# EAGLE design SECDONGL_001 (EAGLE 7.7.0)

## Sheet 1 of 3
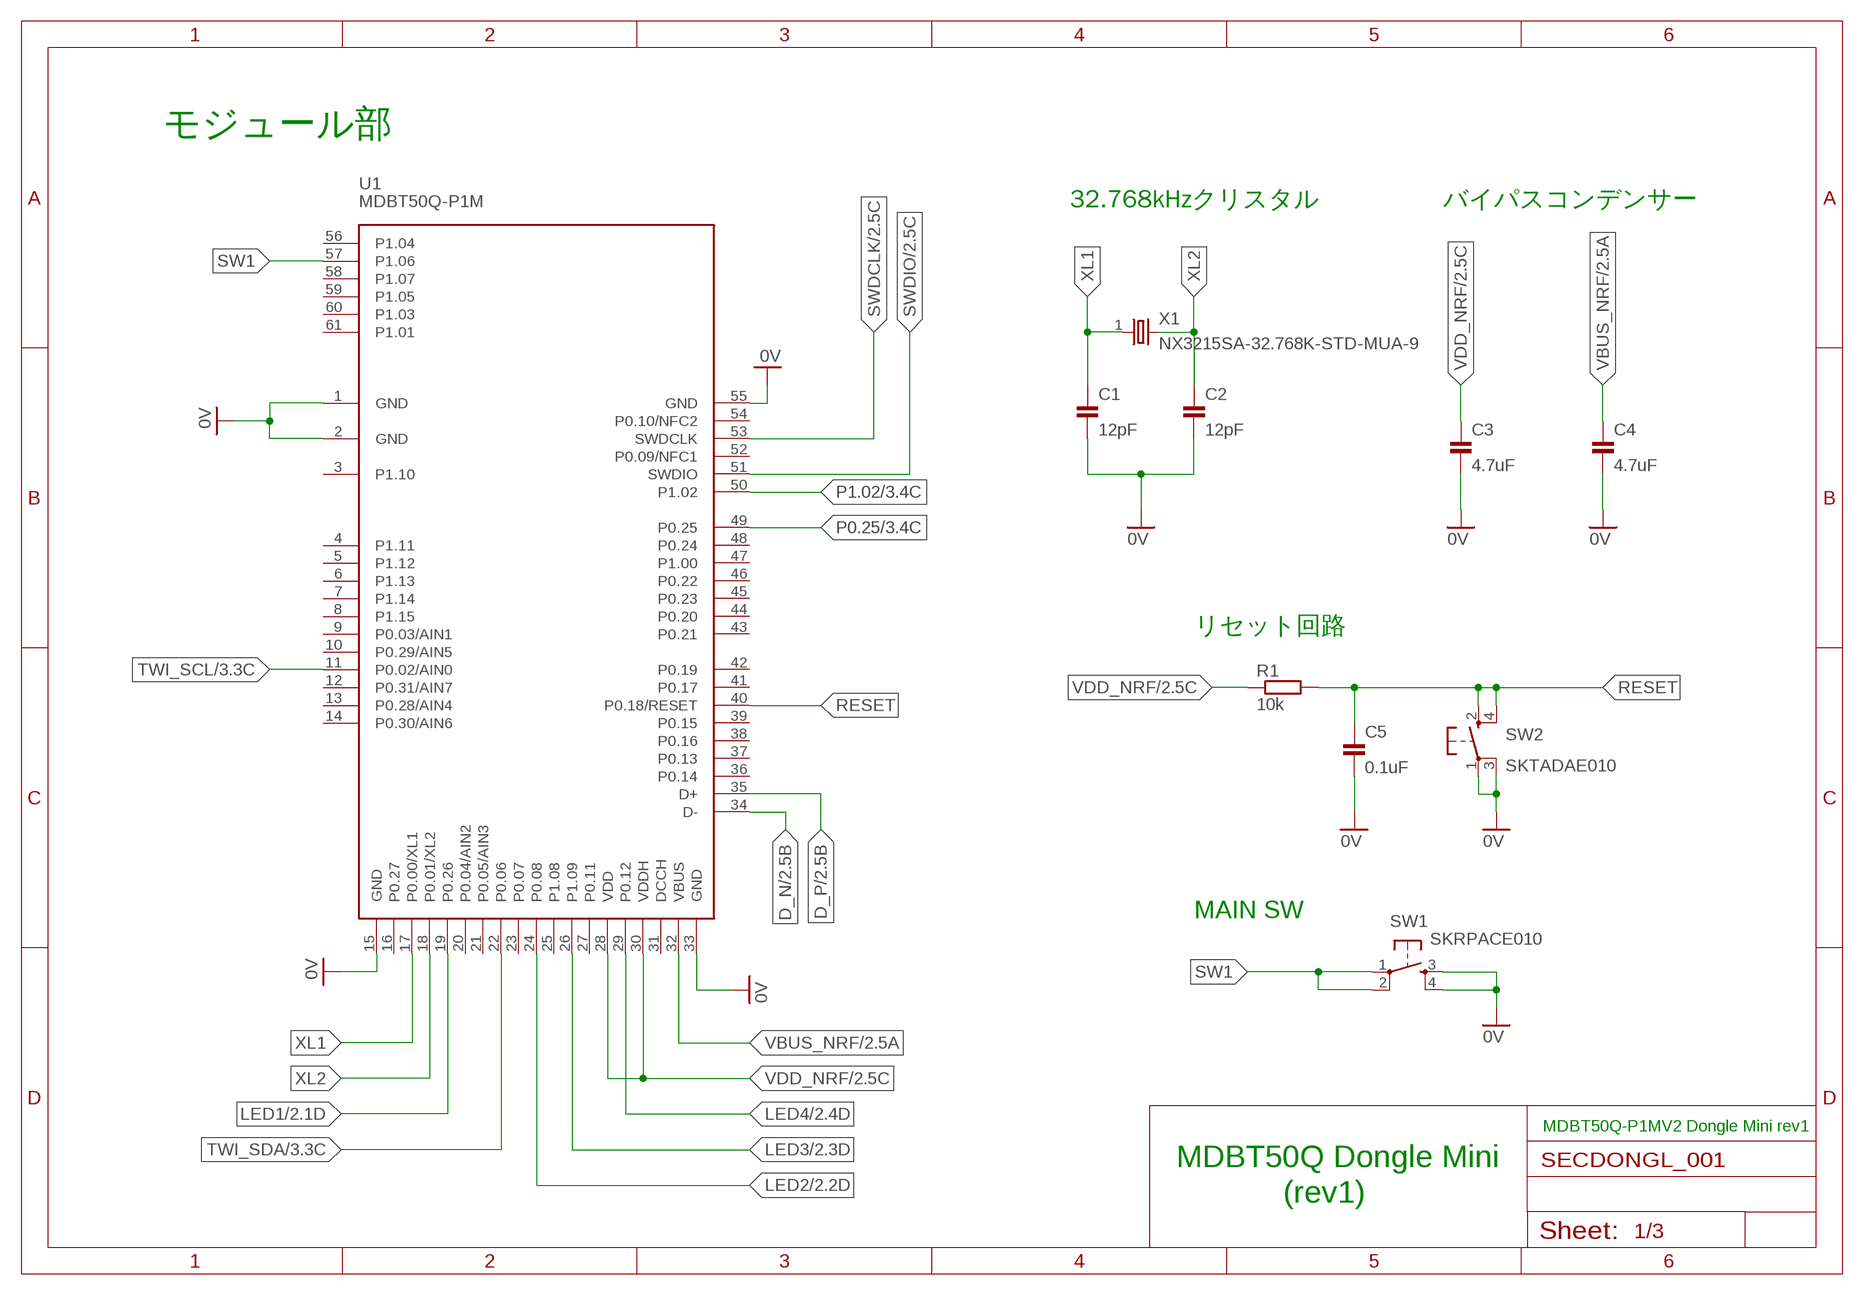
[diagram p0: schematic, sheet 1]

### Parts
C1  12pF  CAP_0603  [C0603K]
C2  12pF  CAP_0603  [C0603K]
C3  4.7uF  CAP_0603  [C0603K]
C4  4.7uF  CAP_0603  [C0603K]
C5  0.1uF  CAP_0402K  [C0402K]
R1  10k  RESISTOR_0402  [R0402]
SW1  SKRPACE010  [SKRPACE010]
SW2  SKTADAE010  [SKTADAE010]
U1  MDBT50Q-P1M  [MDBT50Q-P1M]
X1  NX3215SA-32.768K-STD-MUA-9  [NX3215]

### Nets
0V: C1.2 C2.2 C3.2 C4.2 C5.2 SW1.3(S) SW1.4(S1) SW2.1(P) SW2.3(P1) U1.1(GND) U1.2(GND) U1.15(GND) U1.33(GND) U1.55(GND) ; also sheet 2,3
D_N: U1.34(D-) ; also sheet 2
D_P: U1.35(D+) ; also sheet 2
LED1: U1.19(P0.26) ; also sheet 2
LED2: U1.24(P0.08) ; also sheet 2
LED3: U1.26(P1.09) ; also sheet 2
LED4: U1.29(P0.12) ; also sheet 2
P0.25: U1.49(P0.25) ; also sheet 3
P1.02: U1.50(P1.02) ; also sheet 3
RESET: C5.1 R1.2 SW2.2(S) SW2.4(S1) U1.40(P0.18/RESET)
SW1: SW1.1(P) SW1.2(P1) U1.57(P1.06)
SWDCLK: U1.53(SWDCLK) ; also sheet 2
SWDIO: U1.51(SWDIO) ; also sheet 2
TWI_SCL: U1.11(P0.02/AIN0) ; also sheet 3
TWI_SDA: U1.22(P0.06) ; also sheet 3
VBUS_NRF: C4.1 U1.32(VBUS) ; also sheet 2,3
VDD_NRF: C3.1 R1.1 U1.28(VDD) U1.30(VDDH) ; also sheet 2,3
XL1: C1.1 U1.17(P0.00/XL1) X1.1
XL2: C2.1 U1.18(P0.01/XL2) X1.2
Unconnected: U1.3(P1.10) U1.4(P1.11) U1.5(P1.12) U1.6(P1.13) U1.7(P1.14) U1.8(P1.15) U1.9(P0.03/AIN1) U1.10(P0.29/AIN5) U1.12(P0.31/AIN7) U1.13(P0.28/AIN4) U1.14(P0.30/AIN6) U1.16(P0.27) U1.20(P0.04/AIN2) U1.21(P0.05/AIN3) U1.23(P0.07) U1.25(P1.08) U1.27(P0.11) U1.31(DCCH) U1.36(P0.14) U1.37(P0.13) U1.38(P0.16) U1.39(P0.15) U1.41(P0.17) U1.42(P0.19) U1.43(P0.21) U1.44(P0.20) U1.45(P0.23) U1.46(P0.22) U1.47(P1.00) U1.48(P0.24) U1.52(P0.09/NFC1) U1.54(P0.10/NFC2) U1.56(P1.04) U1.58(P1.07) U1.59(P1.05) U1.60(P1.03) U1.61(P1.01)

### Notes on the sheet
- モジュール部
- 32.768kHzクリスタル | バイパスコンデンサー
- リセット回路
- MAIN SW
- MDBT50Q-P1MV2 Dongle Mini rev1
- MDBT50Q Dongle Mini
- (rev1)

## Sheet 2 of 3
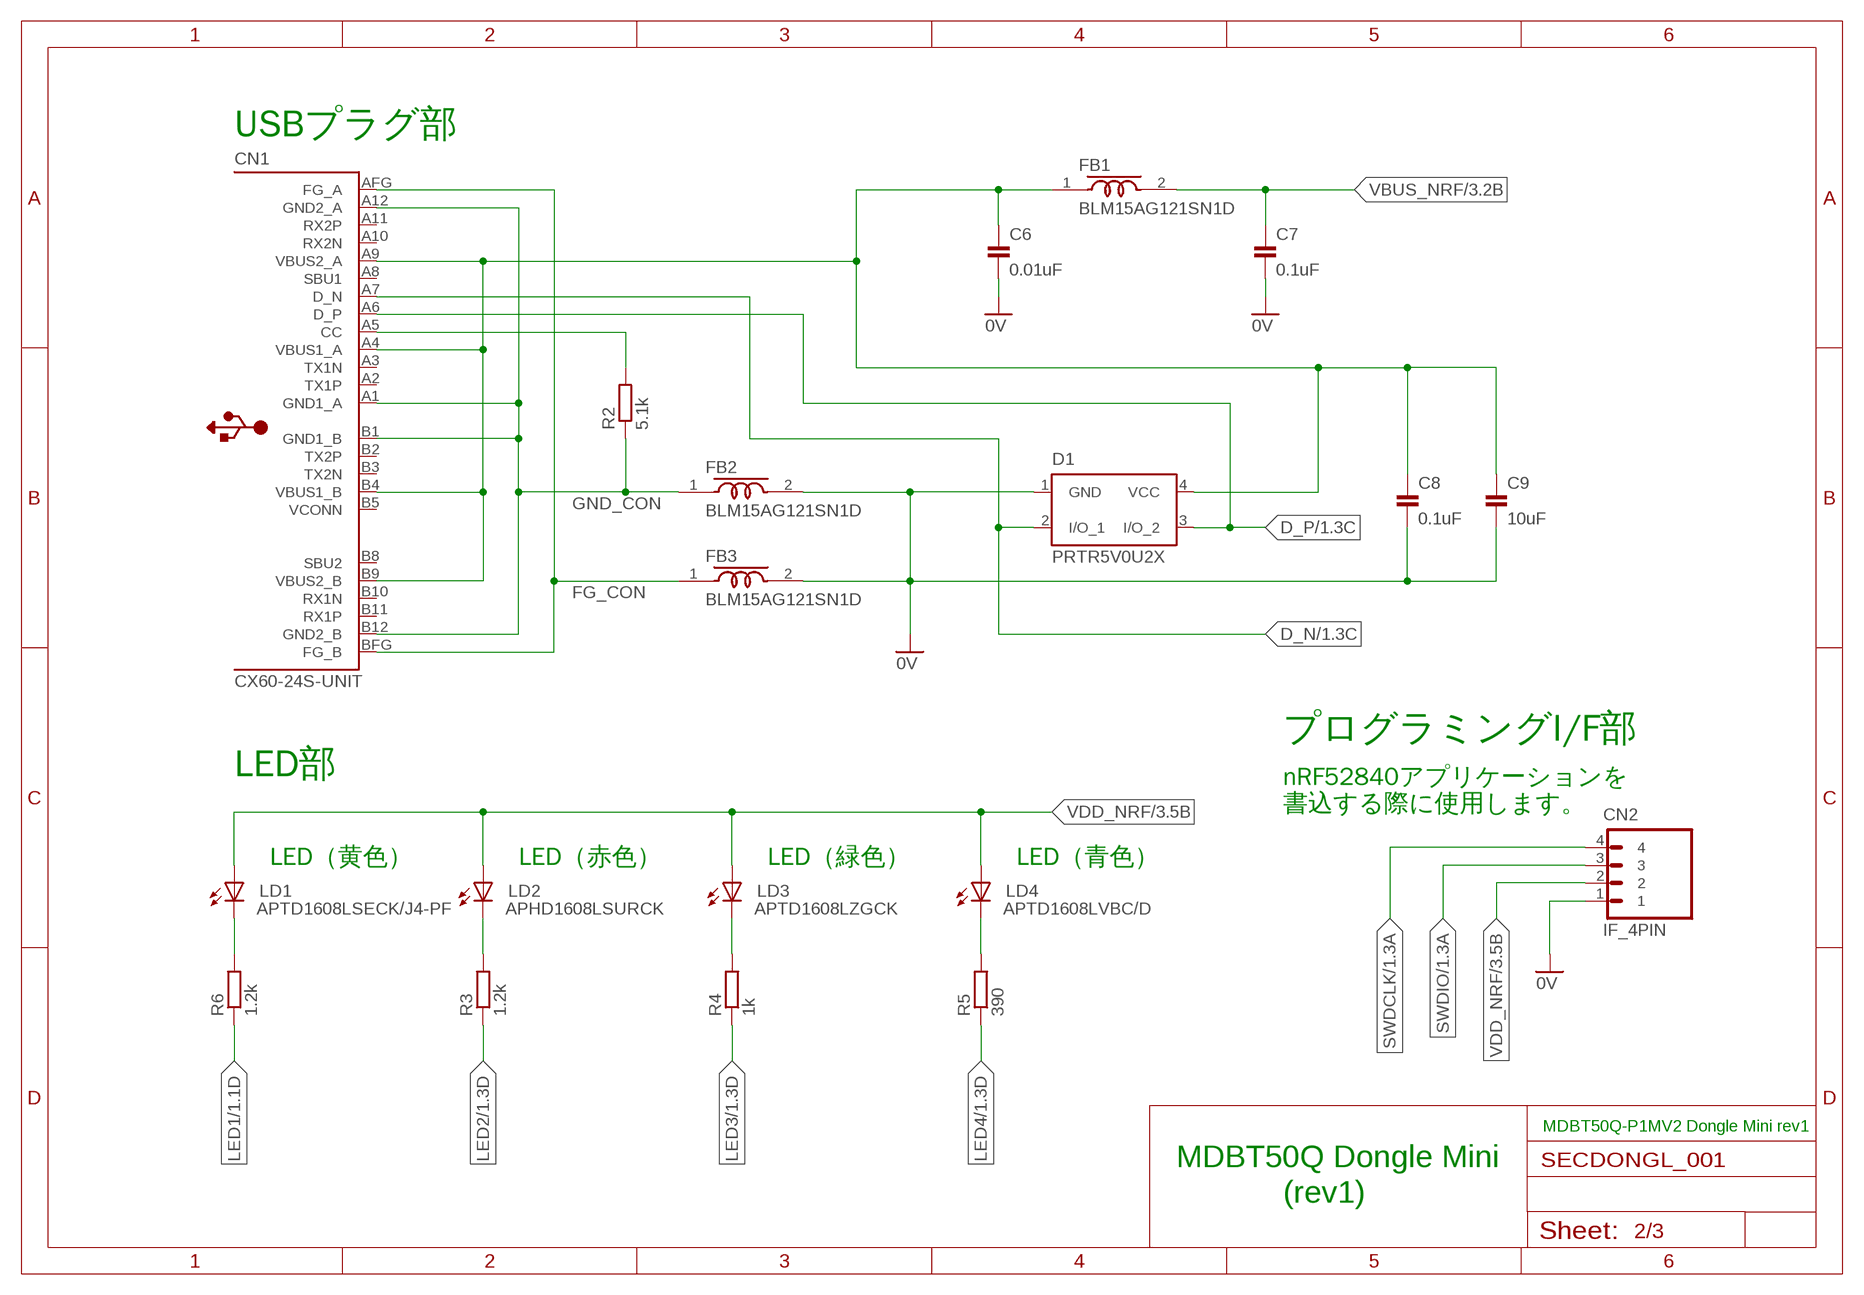
[diagram p1: schematic, sheet 2]

### Parts
C6  0.01uF  CAP_0402K  [C0402K]
C7  0.1uF  CAP_0402K  [C0402K]
C8  0.1uF  CAP_0402K  [C0402K]
C9  10uF  CAP_0603  [C0603K]
CN1  CX60-24S-UNIT  [CX60-24S-UNIT]
CN2  IF_4PIN  [HEADER_4PIN]
D1  PRTR5V0U2X  [SOT143B]
FB1  BLM15AG121SN1D  [C0402K]
FB2  BLM15AG121SN1D  [C0402K]
FB3  BLM15AG121SN1D  [C0402K]
LD1  APTD1608LSECK/J4-PF  [APTD1608]
LD2  APHD1608LSURCK  [APTD1608]
LD3  APTD1608LZGCK  [APTD1608]
LD4  APTD1608LVBC/D  [APTD1608]
R2  5.1k  RESISTOR_0402  [R0402]
R3  1.2k  RESISTOR_0402  [R0402]
R4  1k  RESISTOR_0402  [R0402]
R5  390  RESISTOR_0402  [R0402]
R6  1.2k  RESISTOR_0402  [R0402]

### Nets
0V: C6.2 C7.2 C8.2 C9.2 CN2.1 D1.1(GND) FB2.2 FB3.2 ; also sheet 1,3
D_N: CN1.A7(D_N) D1.2(I/O_1) ; also sheet 1
D_P: CN1.A6(D_P) D1.3(I/O_2) ; also sheet 1
FG_CON: CN1.AFG(FG_A) CN1.BFG(FG_B) FB3.1
GND_CON: CN1.A1(GND1_A) CN1.A12(GND2_A) CN1.B1(GND1_B) CN1.B12(GND2_B) FB2.1 R2.1
LED1: R6.1 ; also sheet 1
LED2: R3.1 ; also sheet 1
LED3: R4.1 ; also sheet 1
LED4: R5.1 ; also sheet 1
N$1: LD4.C R5.2
N$2: CN1.A5(CC) R2.2
N$6: LD3.C R4.2
N$7: LD2.C R3.2
N$8: LD1.C R6.2
SWDCLK: CN2.4 ; also sheet 1
SWDIO: CN2.3 ; also sheet 1
VBUS: C6.1 C8.1 C9.1 CN1.A4(VBUS1_A) CN1.A9(VBUS2_A) CN1.B4(VBUS1_B) CN1.B9(VBUS2_B) D1.4(VCC) FB1.1
VBUS_NRF: C7.1 FB1.2 ; also sheet 1,3
VDD_NRF: CN2.2 LD1.A LD2.A LD3.A LD4.A ; also sheet 1,3
Unconnected: CN1.A2(TX1P) CN1.A3(TX1N) CN1.A8(SBU1) CN1.A10(RX2N) CN1.A11(RX2P) CN1.B2(TX2P) CN1.B3(TX2N) CN1.B5(VCONN) CN1.B8(SBU2) CN1.B10(RX1N) CN1.B11(RX1P)

### Notes on the sheet
- USBプラグ部
- プログラミングI/F部
- LED部
- nRF52840アプリケーションを
  書込する際に使用します。
- LED（黄色） | LED（赤色） | LED（緑色） | LED（青色）
- MDBT50Q-P1MV2 Dongle Mini rev1
- MDBT50Q Dongle Mini
- (rev1)

## Sheet 3 of 3
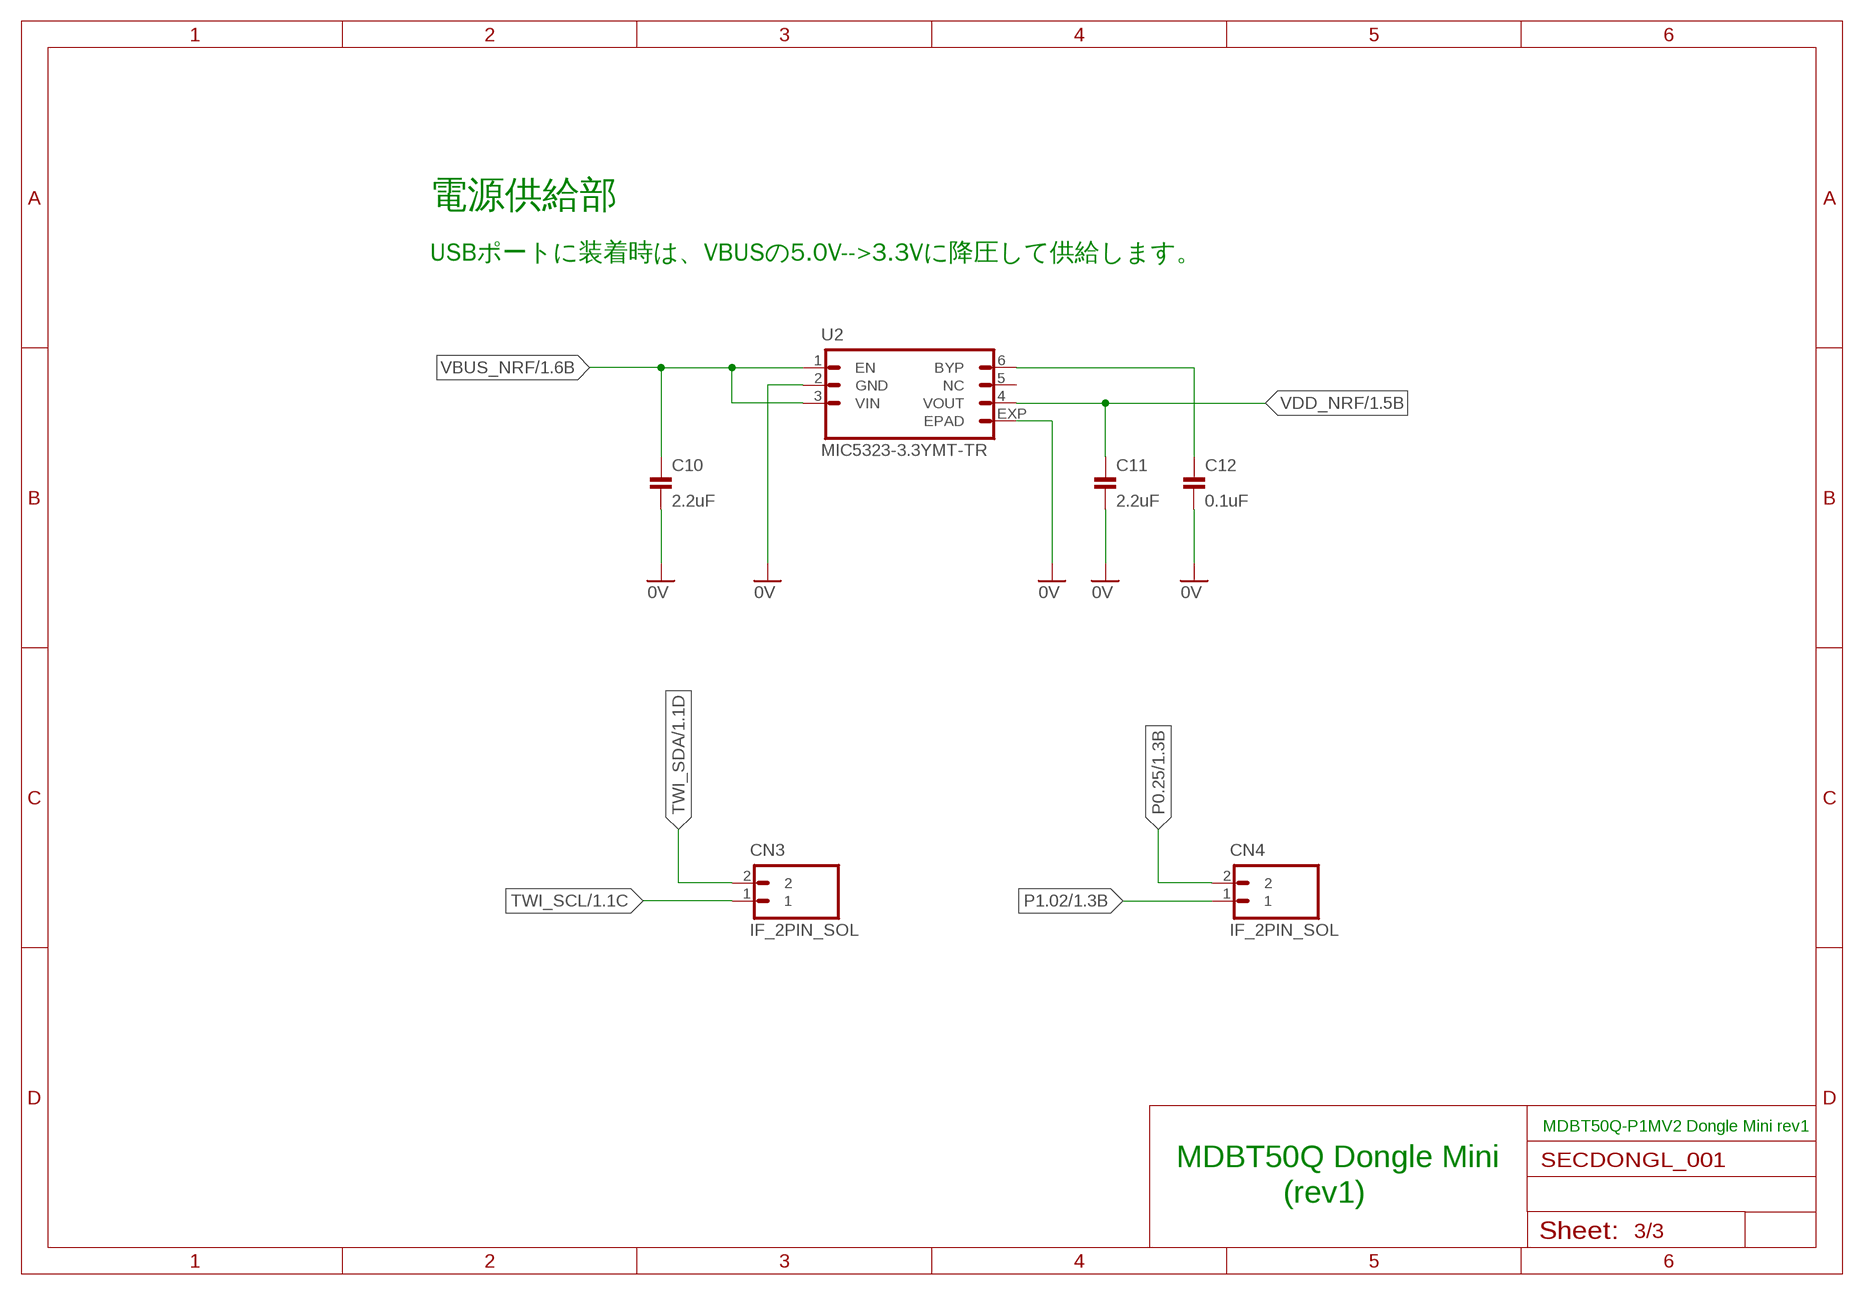
[diagram p2: schematic, sheet 3]

### Parts
C10  2.2uF  CAP_0603  [C0603K]
C11  2.2uF  CAP_0603  [C0603K]
C12  0.1uF  CAP_0402K  [C0402K]
CN3  IF_2PIN_SOL  [SOLPAD_2PIN]
CN4  IF_2PIN_SOL  [SOLPAD_2PIN]
U2  MIC5323-3.3YMT-TR  [6-VDFN(2X2)]

### Nets
0V: C10.2 C11.2 C12.2 U2.2(GND) U2.EXP(EPAD) ; also sheet 1,2
N$4: C12.1 U2.6(BYP)
P0.25: CN4.2 ; also sheet 1
P1.02: CN4.1 ; also sheet 1
TWI_SCL: CN3.1 ; also sheet 1
TWI_SDA: CN3.2 ; also sheet 1
VBUS_NRF: C10.1 U2.1(EN) U2.3(VIN) ; also sheet 1,2
VDD_NRF: C11.1 U2.4(VOUT) ; also sheet 1,2
Unconnected: U2.5(NC)

### Notes on the sheet
- 電源供給部
- USBポートに装着時は、VBUSの5.0V-->3.3Vに降圧して供給します。
- MDBT50Q-P1MV2 Dongle Mini rev1
- MDBT50Q Dongle Mini
- (rev1)

## Library data of the parts
C1-C12 = Parts:CAP: コンデンサー
CN1 = Connectors:CX60-24S-UNIT: USB Type-C(TM) plug
CN2 = Connectors:IF_4PIN: 4-pin インターフェース
CN3 CN4 = Connectors:IF_2PIN: 2-pin インターフェース
D1 = Parts:PRTR5V0U2X: ESD protection diode
FB1-FB3 = Parts:BLM15AG: フェライトビーズ EMIFIL®
LD1 LD3 LD4 = Parts:APTD1608: 発光ダイオード
LD2 = Parts:APHD1608: 発光ダイオード
R1-R6 = Parts:RESISTOR: 抵抗器
SW1 = Parts:SKRPACE010: 表面実装用タクトスイッチ ４．２×３．２ｍｍ小型重作動力タイプ ・作動力：２．５５Ｎ ・操作方向：垂直 ・移動量：０．２ｍｍ ・動作寿命：５０，０００ｃｙｃｌｅｓ （５ｍＡ ５ＶＤＣ） ・初期接触抵抗：最大５００ｍΩ
SW2 = Parts:SKTADAE010: 表面実装用タクトスイッチ 2.6×1.6ｍｍ小型重作動力タイプ ・作動力：2.4 N ・操作方向：垂直 ・移動量：0.11 mm ・定格：50 mA 12 VDC
U1 = Modules:MDBT50Q-P1M: MDBT50Q – P1M (PCB Antenna) Bluetooth 5, IEEE 802.15.4, 2.4 GHz transceiver ARM Cortex –M4 32-bit processor with FPU, 64 MHz Memory: 1MB flash / 256KB RAM ‧Supply voltage range 1.7V to 5.5V ‧On-chip DC/DC and LDO regulators with automated low current modes ‧Regulated supply for external components from 1.8V to 3.3V ‧0.4uA at 3V in System OFF mode, no RAM retention ‧1.5uA at 3V in System ON mode, no RAM retention, wake on RTC Working distance 1Mbps: up to 250 meters in open space 2Mbps: up to 120 meters in open space
U2 = ICs:MIC5323: Ultra-Low Dropout LDO Regulator 電圧 - 入力（最大）：5.5V 電圧 - 出力（最小/固定）：3.3V 電流 - 出力：500mA 動作温度：-40°C～125°C
X1 = Parts:NX3215SA: 水晶振動子 周波数 32.768kHz 周波数公差 ±20ppm 負荷容量 6pF ESR（等価直列抵抗） 70 kOhms 動作温度 -40°C～85°C

## Board
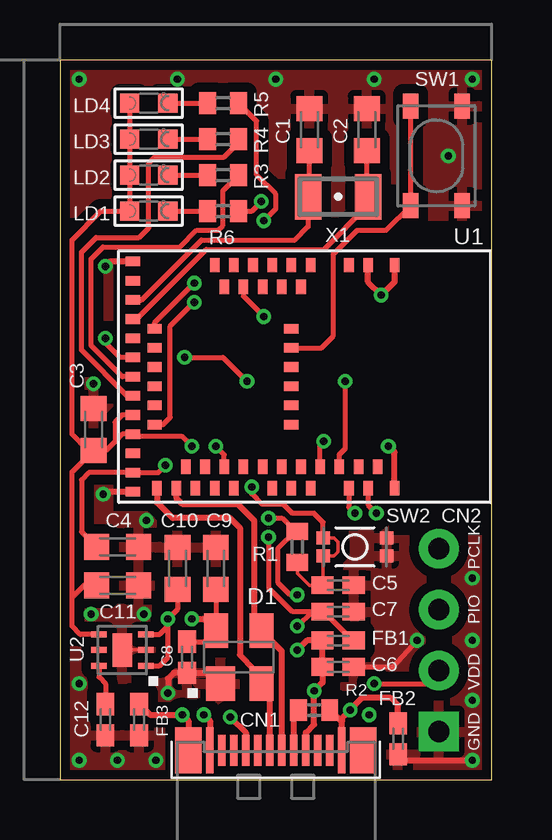
[diagram p3: board, top side]
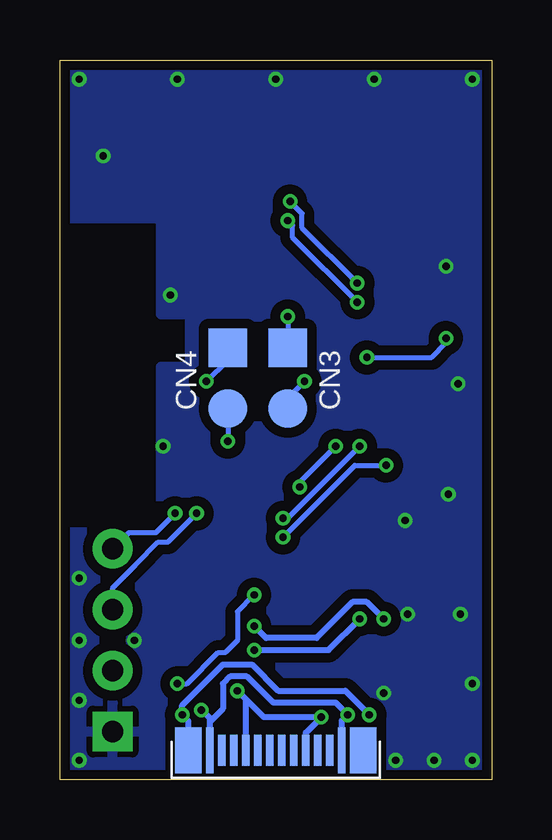
[diagram p4: board, bottom side, seen from below]

Size 18 x 30 mm. Coordinates in mm from the lower left corner, seen from the top.
Outline: 0,0 18,0 18,30 0,30 0,0
Copper layers (1*16): Top 0.035mm / dielectric 1.5mm / Bottom 0.035mm
Design rules "SeeedStudio_2layer_DRU_no_angle_20140221": minimum track width 6mil, minimum drill 12mil, track to track 6mil, track to pad 6mil, pad to pad 6mil, via to via 6mil, smd to smd 0mil, copper to edge 10mil, drill to drill 10mil, minimum pad ring 10mil, minimum via ring 6mil, stop-mask expansion 2mil, vias tented up to drill 100mil, thermal gap 10mil

### Footprints (pad centres in the part's own frame; a part is rotated, then mirrored left to right if it is on the bottom)
C0603K = smd 1.05 x 1.08: 1 -0.875,0; 2 0.875,0
C0402K = smd 0.925 x 0.74: 1 -0.65,0; 2 0.65,0
CX60-24S-UNIT = smd 0.3 x 1.9: A1 2.75,0; A12 -2.75,0 | smd 0.3 x 1.3: A2 2.25,0; A3 1.75,0; A4 1.25,0; A5 0.75,0; A6 0.25,0; A7 -0.25,0; A8 -0.75,0; A9 -1.25,0; A10 -1.75,0; A11 -2.25,0 | smd 1.1 x 1.9: ADUM 3.64,0; AFG -3.64,0 | smd 0.3 x 1.9 bottom: B1 -2.75,0; B12 2.75,0 | smd 0.3 x 1.3 bottom: B2 -2.25,0; B3 -1.75,0; B4 -1.25,0; B5 -0.75,0; B6 -0.25,0; B7 0.25,0; B8 0.75,0; B9 1.25,0; B10 1.75,0; B11 2.25,0 | smd 1.1 x 1.9 bottom: BDUM -3.64,0; BFG 3.64,0
HEADER_4PIN = drill 0.889 pad 1.651 square: 1 0,0 | drill 0.889 pad 1.651: 2 2.54,0; 3 5.08,0; 4 7.62,0
SOLPAD_2PIN = smd 1.6 x 1.6: 1 0,0; 2 2.54,0
SOT143B = smd 1.2 x 1.44: 1 -0.75,-1.1 | smd 1 x 1.44: 2 0.95,-1.1; 3 0.95,1.1; 4 -0.95,1.1
APTD1608 = smd 0.8 x 0.8: A -0.8,0; C 0.8,0
R0402 = smd 0.7 x 0.9: 1 -0.65,0; 2 0.65,0
SKRPACE010 = smd 1.05 x 0.65: 1 -2.075,1.075; 2 2.075,1.075; 3 -2.075,-1.075; 4 2.075,-1.075
SKTADAE010 = smd 0.55 x 0.55: 1 -1.325,0.375; 2 1.325,0.375; 3 -1.325,-0.375; 4 1.325,-0.375
MDBT50Q-P1M = smd 0.6 x 0.4: 1 -4.65,3.75; 2 -4.65,2.65; 3 -4.65,1.85; 4 -4.65,0.25; 5 -3.75,-0.15; 6 -4.65,-0.55; 7 -3.75,-0.95; 8 -4.65,-1.35; 9 -3.75,-1.75; 10 -4.65,-2.15; 11 -3.75,-2.55; 12 -4.65,-2.95; 13 -3.75,-3.35; 14 -4.65,-3.75; 34 4.65,-6.15; 35 4.65,-5.35; 36 3.75,-4.95; 37 4.65,-4.55; 38 3.75,-4.15; 39 4.65,-3.75; 40 3.75,-3.35; 41 4.65,-2.95; 42 3.75,-2.55; 43 3.75,-1.75; 44 4.65,-1.35; 45 3.75,-0.95; 46 4.65,-0.55; 47 3.75,-0.15; 48 4.65,0.25; 49 3.75,0.65; 50 3.75,1.45; 51 4.65,1.85; 52 3.75,2.25; 53 4.65,2.65; 54 3.75,3.05; 55 4.65,3.75 | smd 0.4 x 0.6: 15 -4.8,-7.15; 16 -4,-7.15; 17 -3.2,-7.15; 18 -2.4,-7.15; 19 -2,-6.25; 20 -1.6,-7.15; 21 -1.2,-6.25; 22 -0.8,-7.15; 23 -0.4,-6.25; 24 0,-7.15; 25 0.4,-6.25; 26 0.8,-7.15; 27 1.2,-6.25; 28 1.6,-7.15; 29 2,-6.25; 30 2.4,-7.15; 31 3.2,-7.15; 32 4,-7.15; 33 4.8,-7.15; 56 -2,-0.55; 57 -1.2,-0.55; 58 -0.4,-0.55; 59 0.4,-0.55; 60 1.2,-0.55; 61 2,-0.55
6-VDFN(2X2) = smd 0.65 x 0.25: 1 -0.975,0.65; 2 -0.975,0; 3 -0.975,-0.65; 4 0.975,-0.65; 5 0.975,0; 6 0.975,0.65 | smd 0.8 x 1.4: EXP 0,0
NX3215 = smd 1.1 x 1.9: 1 -1.25,0; 2 1.25,0

### Placement (x,y rotation side)
C1  10.4,27.1 90 top
C2  12.8,27.1 90 top
C3  1.4,14.6 90 top
C4  2.4,9.7 0 top
C5  11.6,8.1 0 top
C6  11.6,4.7 0 top
C7  11.6,7 0 top
C8  5.3,5.1 270 top
C9  6.5,8.8 90 top
C10  4.9,8.8 90 top
C11  2.4,8.1 0 top
C12  1.9,2.5 270 top
CN1  9,1.22 0 top
CN2  15.8,2 90 top
CN3  8.5,18 270 bottom
CN4  11,18 270 bottom
D1  7.45,5.1 0 top
FB1  11.6,5.8 0 top
FB2  14.1,1.7 270 top
FB3  3.3,2.5 270 top
LD1  3.7,23.7 0 top
LD2  3.7,25.2 0 top
LD3  3.7,26.7 0 top
LD4  3.7,28.2 0 top
R1  9.9,9.7 270 top
R2  10.6,2.9 180 top
R3  6.8,25.2 180 top
R4  6.8,26.7 180 top
R5  6.8,28.2 180 top
R6  6.8,23.7 180 top
SW1  15.7,26 90 top
SW2  12.3,9.7 180 top
U1  10.2,16.8 270 top
U2  2.6,5.4 180 top
X1  11.6,24.3 0 top

### Tracks (layer width: path | path; a pad name or v marks a point on that pad's centre or on a via)
0V  (via drill 0.3)
  Top 0.152: U2.EXP U2.2
  Top 0.203: C6.2 13.9,4.7 v14.9,5.8
  Top 0.254: U1.55 13.95,13.65 v13.7,13.9 | U1.2 12.85,20.75 v13.4,20.2 13.95,20.75 U1.1 | U1.15 2.1,21.6 v1.9,21.4 | v4.5,3.6 4.5,4.2 4.75,4.45 C8.2 6.25,4.45 D1.1 | 17.1,0.7 v17.2,0.8 14.35,0.8 FB2.2 | U1.33 1.9,12 v1.8,11.9
  other vias: 0.8,4 0.8,0.8 16.2,26 1.4,16.5 17.2,5.8 17.2,8.4 17.2,3.3 0.8,29.2 17.2,29.2 9,29.2 4.9,29.2 13.1,29.2 4,0.8 3.6,10.8 3.5,6.9 1.3,6.9 2.4,0.8
  pour Bottom (isolate 0.406, rank 3): -1,31 19,31 19,23.4 13.8,23.4 13.8,19.4 12.6,19.4 12.6,17.2 13.8,17.2 13.8,10.3 19,10.3 19,-1 -1,-1
  pour Top (isolate 0.406): -0.5,30.5 18.5,30.5 18.5,23.5 13.5,23.5 13.5,22.5 2,22.5 2,11 13.5,11 13.5,10 18.5,10 18.5,-0.5 -0.5,-0.5
  pour Bottom (isolate 0.406, rank 3): -1,31 19,31 19,23.4 13.8,23.4 13.8,19.4 12.6,19.4 12.6,17.2 13.8,17.2 13.8,10.3 19,10.3 19,-1 -1,-1
D_N
  Top 0.254: CN1.A7 8.75,3.65 D1.2 8.1,4.3 8.1,4.6 7.5,5.2 7.5,10.5 7.1,10.9 4.7,10.9 4.05,11.55 U1.34
D_P
  Top 0.254: 8.1,6.4 arc90 D1.3 | U1.35 4.85,11.75 5.1,11.5 7.4,11.5 8.1,10.8 8.1,6.5 D1.3 | CN1.A6 9.25,5.35 D1.3
FG_CON  (via drill 0.3)
  Top 0.254: CN1.AFG 5.36,2.44 v5.1,2.7 3.75,2.7 FB3.1
  Bottom 0.254: v5.1,2.7 6.1,3.7 8.9,3.7 10,4.8 11.2,4.8 12.9,3.1 v12.9,2.7 12.64,2.44 CN1.BFG
GND_CON  (via drill 0.3)
  Top 0.254: CN1.A1 11.75,2.4 | 11.75,2.4 R2.1 | 11.75,2.4 11.75,2.55 v12.1,2.9 12.6,3.4 13.8,3.4 14.1,3.1 FB2.1 | v6,2.7 6.25,2.45 CN1.A12
  Bottom 0.254: CN1.A1 11.75,2.4 | 11.75,2.4 11.75,2.55 v12.1,2.9 | 11.75,2.4 11.2,2.95 11.2,4 10.9,4.3 10.2,4.3 9.1,3.2 6.5,3.2 v6,2.7 6.25,2.45 CN1.A12
LED1  (via drill 0.3)
  Top 0.203: U1.19 3.95,19.05 v5.6,20.7 | R6.1 8,23.7 v8.4,24.1
  Bottom 0.203: v8.4,24.1 7.9,23.6 7.9,23 v5.6,20.7
LED2
  Top 0.203: U1.24 2.6,16.8 1.3,18.1 1.3,21.7 1.8,22.2 5,22.2 5.7,22.9 6.6,22.9 6.8,23.1 6.8,24.55 R3.1
LED3
  Top 0.203: U1.26 2.8,16 0.9,17.9 0.9,22 1.5,22.6 3.3,22.6 3.7,23 3.7,25.7 3.95,25.95 6.85,25.95 7.45,26.55 R4.1
LED4  (via drill 0.3)
  Top 0.203: U1.29 4.3,14.8 4.6,15.1 4.6,18.9 v5.6,19.9 | v8.5,23.3 9,23.8 9,24.4 8.2,25.2 8.2,27.45 R5.1
  Bottom 0.203: v5.6,19.9 8.3,22.6 8.3,23.1 v8.5,23.3
N$1
  Top 0.203: LD4.C R5.2
N$2
  Top 0.254: CN1.A5 9.75,2.8 R2.2
N$4
  Top 0.203: U2.6 1.62,4.28 1.9,4 C12.1
N$6
  Top 0.203: LD3.C R4.2
N$7
  Top 0.203: LD2.C R3.2
N$8
  Top 0.203: LD1.C R6.2
P0.25  (via drill 0.3)
  Top 0.203: U1.49 10.85,13.95 v11,14.1
  Bottom 0.203: CN4.2 v11,14.1
P1.02  (via drill 0.3)
  Top 0.203: U1.50 11.65,13.55 11.9,13.8 v11.9,16.6
  Bottom 0.203: v11.9,16.6 11,17.5 CN4.1
RESET  (via drill 0.3)
  Top 0.152: R1.2 9.9,8.6 10.4,8.1 C5.1 10.97,8.12 SW2.2 11.43,9.32 11.6,9.5 11.6,9.9 11.43,10.07 SW2.4
  Top 0.203: U1.40 6.85,13.55 v6.5,13.9 | v8,12.2 8,11.9 8.4,11.5 9.3,11.5 9.7,11.1 10.6,11.1 10.97,10.72 SW2.4
  Bottom 0.203: v8,12.2 8,12.4 v6.5,13.9
SW1
  Top 0.203: SW1.2 SW1.1 13.6,22.9 12.4,22.9 11.4,21.9 11.4,18.5 10.9,18 U1.57
SWDCLK  (via drill 0.3)
  Top 0.203: U1.53 12.85,11.45 v13.2,11.1
  Bottom 0.203: CN2.4 15.12,10.3 14,10.3 v13.2,11.1
SWDIO  (via drill 0.3)
  Top 0.203: U1.51 12.05,11.35 v12.3,11.1
  Bottom 0.203: v12.3,11.1 13.5,9.9 13.9,9.9 14.85,8.95 15.3,8.5 15.8,8 CN2.3
TWI_SCL  (via drill 0.3)
  Top 0.203: U1.11 7.65,20.15 v8.5,19.3
  Bottom 0.203: v8.5,19.3 CN3.1
TWI_SDA  (via drill 0.3)
  Top 0.152: U1.22 arc-90 3.13,17.68 arc90 3.21,17.6
  Top 0.203: U1.22 2.5,17.6 1.9,18.2 v1.9,18.4 | v5.2,17.6 6.8,17.6 v7.8,16.6
  Bottom 0.203: v7.8,16.6 8.5,15.9 CN3.2 | v5.2,17.6 2.5,17.6 1.9,18.2 v1.9,18.4
VBUS  (via drill 0.3)
  Top 0.203: C8.1 6.05,5.75 | C9.1 D1.4
  Top 0.254: CN1.B9 10.25,1.95 10.6,2.3 v10.6,3.7 10.95,4.05 C6.1 FB1.1 10.3,5.8 v9.9,5.4 | v7.1,2.6 7.75,1.95 CN1.B4 | v5.5,6.7 6,6.7 D1.4 6.05,5.75
  Bottom 0.254: CN1.B4 7.75,1.95 v7.1,2.6 9.5,2.6 v10.6,3.7 10.25,3.35 CN1.B9 | v9.9,5.4 6.8,5.4 v5.5,6.7
VBUS_NRF  (via drill 0.3)
  Top 0.203: FB1.2 12.2,5.8 11,7 C7.1 10.5,7 | v9.9,6.4 10.5,7 | 10.5,7 9.7,7 8.7,8 v8.7,10.1 | v4.4,13.1 4.1,12.8 U1.32 1.2,12.8 0.9,12.5 0.9,10.32 C4.1 | C10.1 4.9,7.1 v4.5,6.7 | U2.3 4.15,6.05 4.5,6.4 v4.5,6.7 | U2.1 4.15,4.75 4.5,5.1 v4.5,6.7
  Bottom 0.203: v8.7,10.1 5.7,13.1 v4.4,13.1
  Bottom 0.254: v4.5,6.7 5.2,7.4 5.8,7.4 7.3,5.9 9.4,5.9 v9.9,6.4
VDD_NRF  (via drill 0.3)
  Top 0.203: LD4.A LD3.A LD2.A LD1.A 1.7,23.7 0.5,22.5 0.5,14.4 1.18,13.72 C3.1 | U1.28 2.6,15.2 2.3,14.9 2.3,14.1 | 2.3,14.1 1.9,13.7 1.43,13.7 C3.1 | 2.3,14.1 2.6,14.4 U1.30 3.15,14.3 5.1,14.3 v5.5,13.9 | 0.5,7.6 0.5,6.4 0.85,6.05 U2.4 | 0.5,7.6 0.5,12.82 C3.1 | v13.1,4 15.26,4 CN2.2 | v9.9,7.7 9.6,7.7 9.1,8.2 9.1,9.65 9.8,10.35 | v8.7,10.9 9.25,10.9 9.8,10.35 | 9.8,10.35 R1.1 | C11.1 1,8.1 0.5,7.6
  Bottom 0.203: v13.1,4 12.7,4 11.4,5.3 11.1,5.3 10.6,5.8 10.6,7 v9.9,7.7 | v5.5,13.9 8.5,10.9 v8.7,10.9
XL1
  Top 0.203: U1.17 3.4,20 5.9,22.5 9.8,22.5 10.35,23.05 X1.1 10.4,24.35 C1.1
XL2
  Top 0.203: 3.2,19.2 6.1,22.1 11,22.1 12.85,23.95 X1.2 12.8,24.35 C2.1
  Top 0.254: U1.18 3.2,19.2

### Text on the board
tPlace: PCLK | PIO | VDD | GND